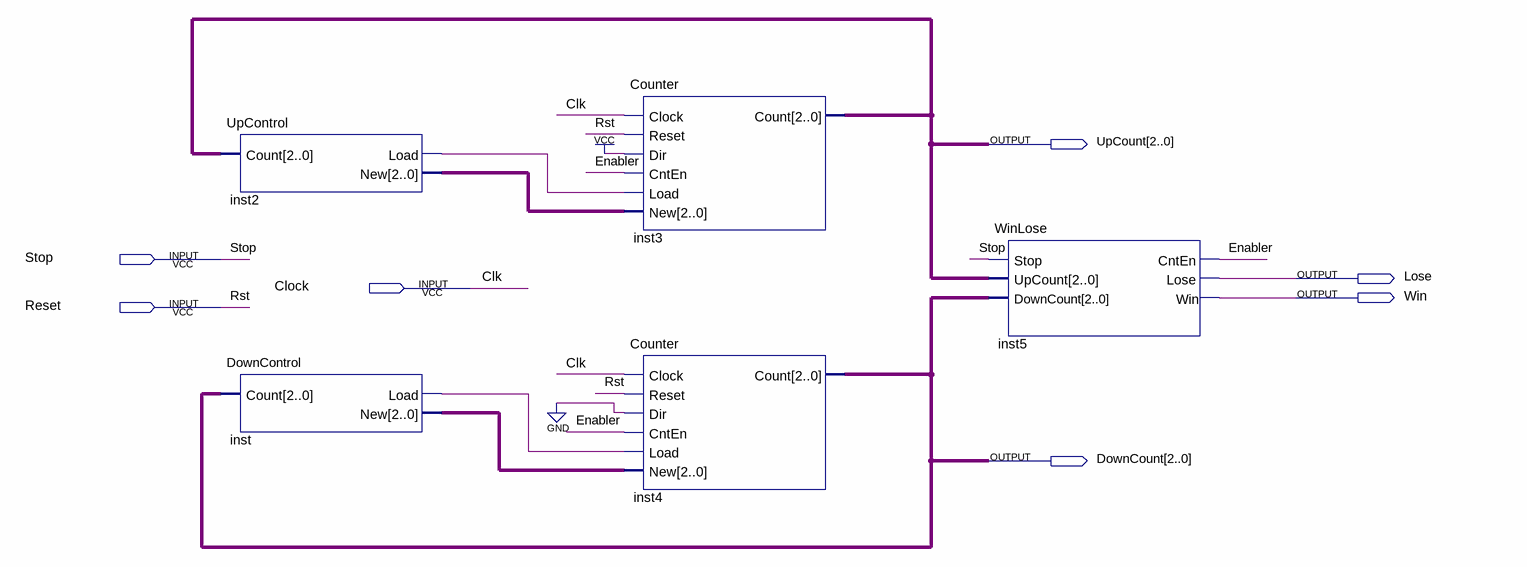
[diagram p0: schematic sheet]
// Quartus schematic lab7.bdf as structural Verilog: 5 symbols, 7 pins
module lab7 (
  input  Stop,
  input  Clock,
  input  Reset,
  output [2:0] UpCount,
  output Lose,
  output Win,
  output [2:0] DownCount
);

  wire Enabler, inst2_load, inst_load;
  wire [2:0] inst2_new, inst_new;

  UpControl inst2 (.Count(UpCount), .Load(inst2_load), .New(inst2_new));
  DownControl inst (.Count(DownCount), .Load(inst_load), .New(inst_new));
  Counter inst3 (
    .Clock(Clock), .Reset(Reset), .Dir(1'b1), .CntEn(Enabler), .Load(inst2_load), .New(inst2_new),
    .Count(UpCount));
  Counter inst4 (
    .Clock(Clock), .Reset(Reset), .Dir(1'b0), .CntEn(Enabler), .Load(inst_load), .New(inst_new),
    .Count(DownCount));
  WinLose inst5 (.Stop(Stop), .UpCount(UpCount), .DownCount(DownCount), .CntEn(Enabler), .Lose(Lose), .Win(Win));

  // Other names for the same wires on the sheet: Clk = Clock; Rst = Reset
endmodule
